# EAGLE schematic PCB-PWR-CON3 (EAGLE 7.1.0)
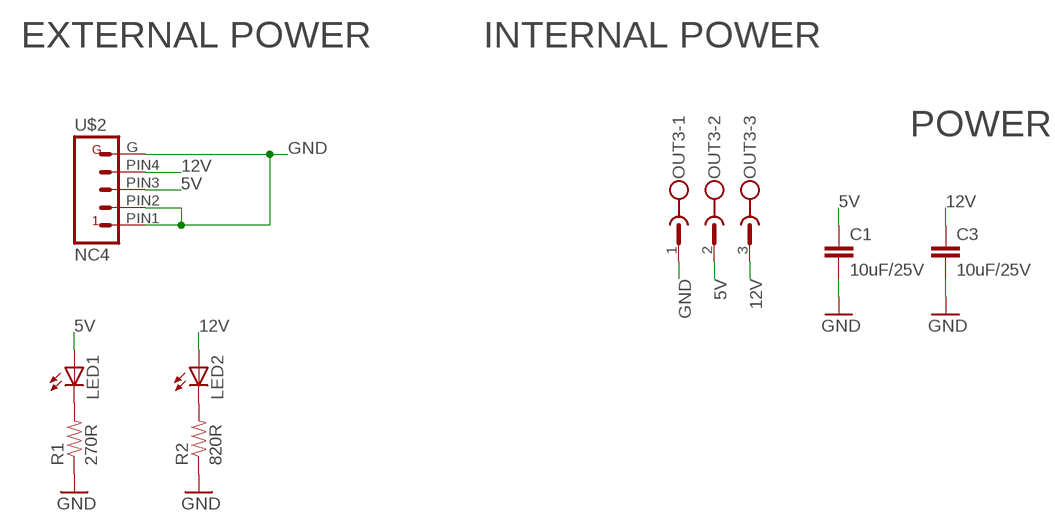
[diagram p0: schematic, sheet 1]

## Parts
C1  10uF/25V  CAP0805  [0805]
C3  10uF/25V  CAP0805  [0805]
LED1  LED3MM  [LED3MM]
LED2  LED3MM  [LED3MM]
OUT3  CON1  MSTBV3  [MSTBV3]
R1  270R  RESISTOR0603-RES  [0603-RES]
R2  820R  RESISTOR0603-RES  [0603-RES]
U$2  NC4  [NC4-MD-L1]

## Nets
5V [PWR]: C1.1 LED1.A OUT3.2 U$2.PIN3
12V [PWR]: C3.1 LED2.A OUT3.3 U$2.PIN4
GND [PWR]: C1.2 C3.2 OUT3.1 R1.1 R2.1 U$2.G U$2.PIN1 U$2.PIN2
N$1: LED1.K(C) R1.2
N$2: LED2.K(C) R2.2

## Notes on the sheet
- EXTERNAL POWER | INTERNAL POWER
- POWER

## Library data of the parts
C1 C3 = SparkFun:CAP: Capacitor Standard 0603 ceramic capacitor, and 0.1" leaded capacitor.
LED1 LED2 = SparkFun:LED: LEDs Standard schematic elements and footprints for 5mm, 3mm, 1206, and 0603 sized LEDs. 5mm - Spark Fun Electronics SKU : COM-00529 (and others)
OUT3 = con-phoenix-508:MSTBV3: PHOENIX; MPN: MSTBV 2,5/3-GF-5.08; OC_FARNELL: 1792793; OC_NEWARK: 69R9846
R1 R2 = SparkFun:RESISTOR: Resistor Basic schematic elements and footprints for 0603, 1206, and PTH resistors.
U$2 = SKAARHOJ:NC4

## Net classes
0 default: width 0.254 mm, drill 0.406 mm, clearance 0.254 mm
1 PWR: width 0.813 mm, drill 0.61 mm, clearance 0.254 mm